# EAGLE design Spectron2 (EAGLE 8.0.1)
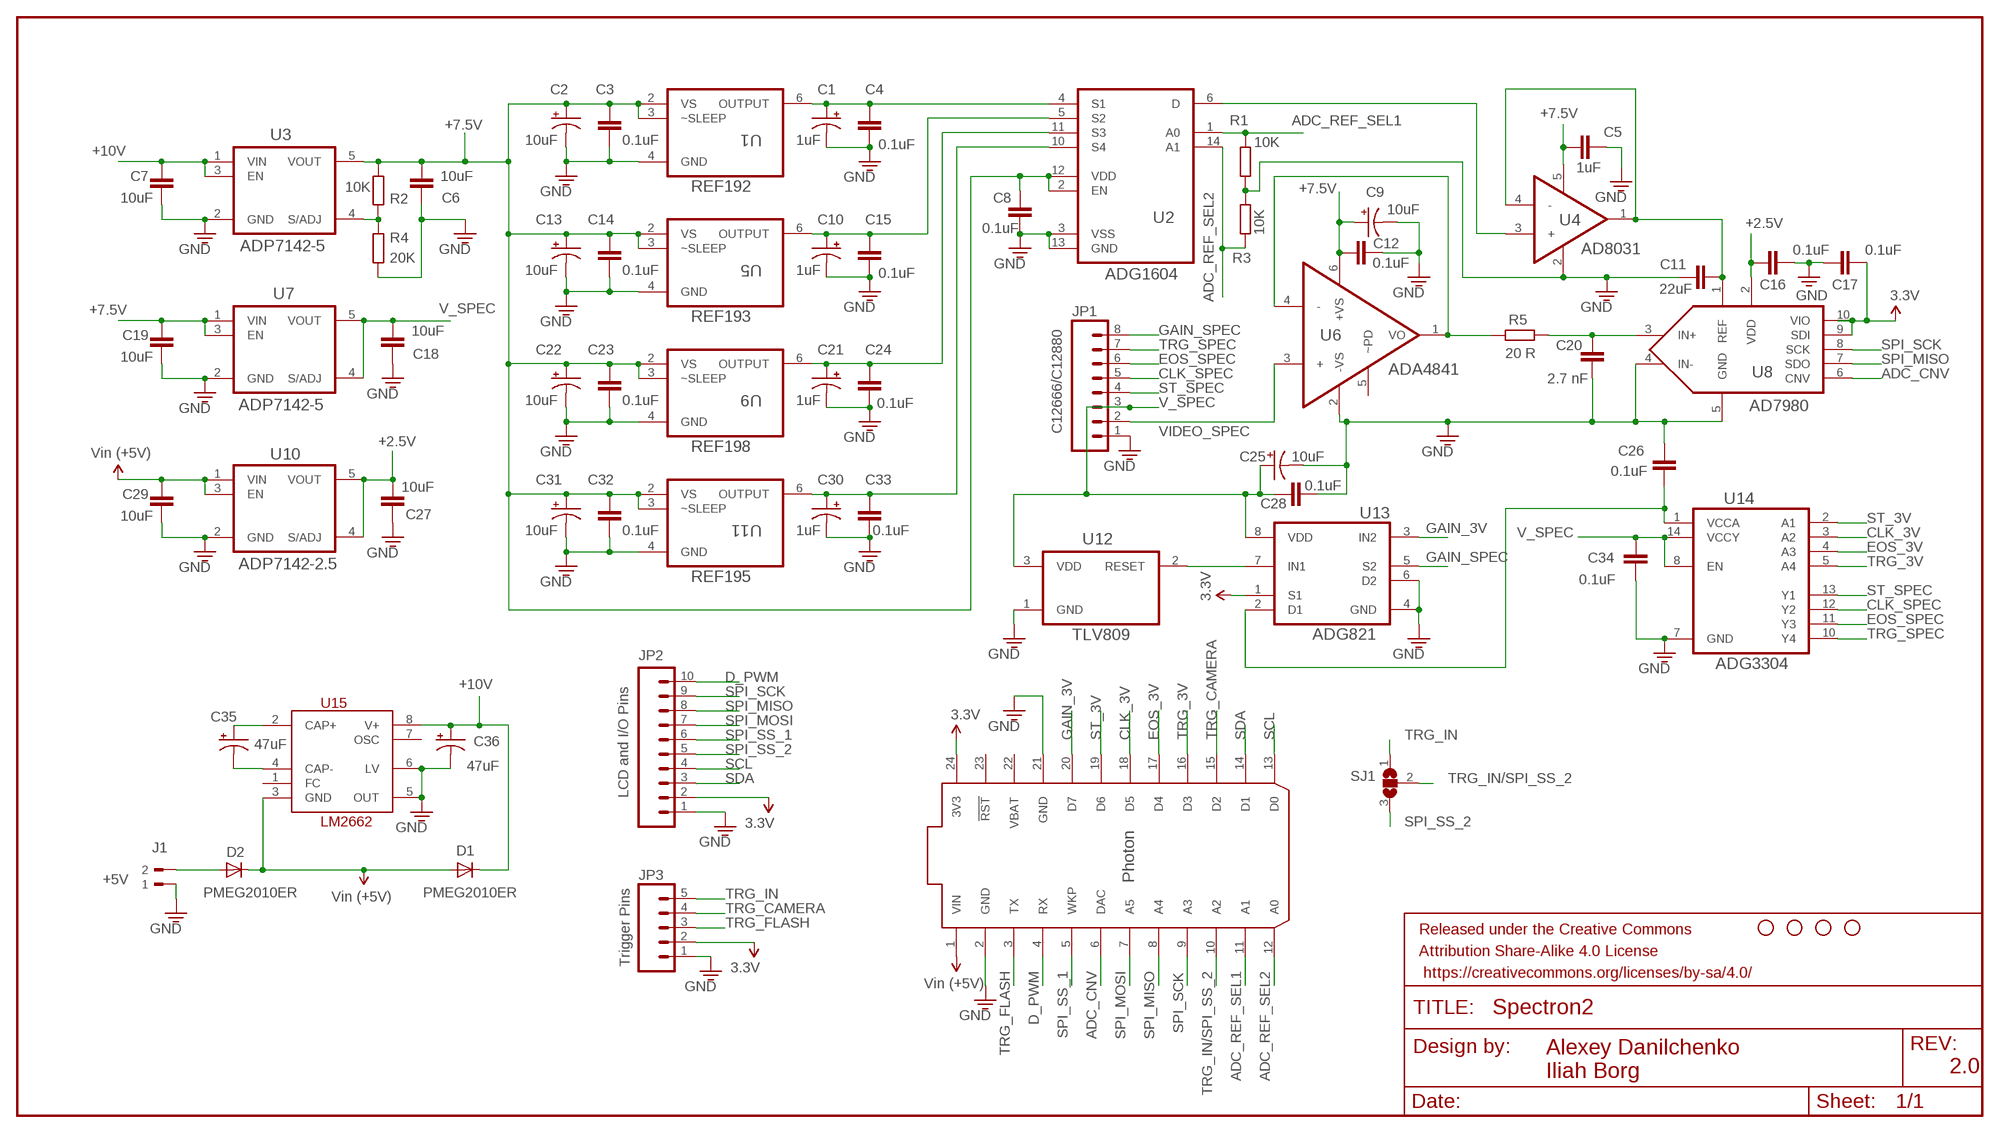
[diagram p0: schematic, sheet 1]

## Parts
C1  1uF  TANT-CAP1206  [EIA3216]
C2  10uF  TANT-CAP1206  [EIA3216]
C3  0.1uF  C-EUC0805  [C0805]
C4  0.1uF  C-EUC0805  [C0805]
C5  1uF  C-EUC0805  [C0805]
C6  10uF  C-EUC0805  [C0805]
C7  10uF  C-EUC0805  [C0805]
C8  0.1uF  C-EUC0805  [C0805]
C9  10uF  TANT-CAP1206  [EIA3216]
C10  1uF  TANT-CAP1206  [EIA3216]
C11  22uF  CAP1206  [1206]
C12  0.1uF  C-EUC0805  [C0805]
C13  10uF  TANT-CAP1206  [EIA3216]
C14  0.1uF  C-EUC0805  [C0805]
C15  0.1uF  C-EUC0805  [C0805]
C16  0.1uF  C-EUC0805  [C0805]
C17  0.1uF  C-EUC0805  [C0805]
C18  10uF  C-EUC0805  [C0805]
C19  10uF  C-EUC0805  [C0805]
C20  2.7 nF  C-EUC0805  [C0805]
C21  1uF  TANT-CAP1206  [EIA3216]
C22  10uF  TANT-CAP1206  [EIA3216]
C23  0.1uF  C-EUC0805  [C0805]
C24  0.1uF  C-EUC0805  [C0805]
C25  10uF  TANT-CAP1206  [EIA3216]
C26  0.1uF  C-EUC0805  [C0805]
C27  10uF  C-EUC0805  [C0805]
C28  0.1uF  C-EUC0805  [C0805]
C29  10uF  C-EUC0805  [C0805]
C30  1uF  TANT-CAP1206  [EIA3216]
C31  10uF  TANT-CAP1206  [EIA3216]
C32  0.1uF  C-EUC0805  [C0805]
C33  0.1uF  C-EUC0805  [C0805]
C34  0.1uF  C-EUC0805  [C0805]
C35  47uF  CPOL-USCT7343  [CT7343]
C36  47uF  CPOL-USCT7343  [CT7343]
D1  PMEG2010ER  DIODE-SOD123  [SOD123]
D2  PMEG2010ER  DIODE-SOD123  [SOD123]
FRAME1  FRAME-LEDGER  [CREATIVE_COMMONS]
J1  +5V  PM5.08/2/90BLK  [WEIDMULLER_PM5.08_2]
JP1  C12666/C12880  M08SILK_FEMALE_PTH  [1X08]
JP2  LCD and I/O Pins  M10SILK_FEMALE_PTH  [1X10]
JP3  Trigger Pins  M05PTH  [1X05]
R1  10K  R-EU_R0805  [R0805]
R2  10K  R-EU_R0805  [R0805]
R3  10K  R-EU_R0805  [R0805]
R4  20K  R-EU_R0805  [R0805]
R5  20 R  R-EU_R0805  [R0805]
SJ1  SJ2W  [SJ_2]
STANDOFF1  STAND-OFF  [STAND-OFF]
STANDOFF2  STAND-OFF  [STAND-OFF]
STANDOFF3  STAND-OFF  [STAND-OFF]
STANDOFF4  STAND-OFF  [STAND-OFF]
U1  REF192  [SOIC127P600X175-8N]
U2  ADG1604  [SOP65P640X120-14N]
U3  ADP7142-5  ADP7142  [SOT95P280X145-5N]
U4  AD8031  [SOT95P280X145-5N]
U5  REF193  [SOIC127P600X175-8N]
U6  ADA4841  [SOT95P280X145-6N]
U7  ADP7142-5  ADP7142  [SOT95P280X145-5N]
U8  AD7980  [SOP50P490X110-10N]
U9  REF198  [SOIC127P600X175-8N]
U10  ADP7142-2.5  ADP7142  [SOT95P280X145-5N]
U11  REF195  [SOIC127P600X175-8N]
U12  TLV809  [SOT95P237X112-3N]
U13  ADG821  [SOP65P490X110-8N]
U14  ADG3304  [SOP65P640X120-14N]
U15  LM2662  [SOIC8]
U16  PHOTON_WITH_HEADERS  [PHOTON]

## Nets
3.3V: C17.2 JP2.2 JP3.2 U8.9(SDI) U8.10(VIO) U13.1(S1) U16.24(3V3)
+2.5V: C16.1 C27.1 U8.2(VDD) U10.4(S/ADJ) U10.5(VOUT)
+7.5V: C2.A(+) C3.2 C5.2 C6.1 C8.2 C9.A(+) C12.2 C13.A(+) C14.2 C19.2 C22.A(+) C23.2 C31.A(+) C32.2 R2.1 U1.2(VS) U1.3(~SLEEP) U2.2(EN) U2.12(VDD) U3.5(VOUT) U4.5(+VS) U5.2(VS) U5.3(~SLEEP) U6.6(+VS) U7.1(VIN) U7.3(EN) U9.2(VS) U9.3(~SLEEP) U11.2(VS) U11.3(~SLEEP)
+10V: C7.2 C36.+ D1.C U3.1(VIN) U3.3(EN) U15.8(V+)
ADC_CNV: U8.6(CNV) U16.6(DAC)
ADC_REF_SEL1: R1.1 U2.1(A0) U16.11(A1)
ADC_REF_SEL2: R3.2 U2.14(A1) U16.12(A0)
CLK_3V: U14.3(A2) U16.18(D5)
CLK_SPEC: JP1.5 U14.12(Y2)
D_PWM: JP2.10 U16.4(RX)
EOS_3V: U14.4(A3) U16.17(D4)
EOS_SPEC: JP1.6 U14.11(Y3)
GAIN_3V: U13.3(IN2) U16.20(D7)
GAIN_SPEC: JP1.8 U13.5(S2)
GND: C1.C(-) C2.C(-) C3.1 C4.1 C5.1 C6.2 C7.1 C8.1 C9.C(-) C10.C(-) C11.1 C12.1 C13.C(-) C14.1 C15.1 C16.2 C17.1 C18.2 C19.1 C20.1 C21.C(-) C22.C(-) C23.1 C24.1 C25.C(-) C26.2 C27.2 C28.1 C29.1 C30.C(-) C31.C(-) C32.1 C33.1 C34.1 C36.- J1.1 JP1.1 JP2.1 JP3.1 R1.2 R3.1 R4.2 U1.4(GND) U2.3(VSS) U2.13(GND) U3.2(GND) U4.2(-VS) U5.4(GND) U6.2(-VS) U7.2(GND) U8.4(IN-) U8.5(GND) U9.4(GND) U10.2(GND) U11.4(GND) U12.1(GND) U13.4(GND) U13.6(D2) U14.7(GND) U15.5(OUT) U15.6(LV) U16.2(GND) U16.21(GND)
N$1: R2.2 R4.1 U3.4(S/ADJ)
N$2: C11.2 U4.1(VOUT) U4.4(-) U8.1(REF)
N$3: C21.A(+) C24.2 U2.11(S3) U9.6(OUTPUT)
N$4: R5.2 U6.1(VO) U6.4(-)
N$5: U12.2(RESET) U13.7(IN1)
N$7: C1.A(+) C4.2 U1.6(OUTPUT) U2.4(S1)
N$8: U2.6(D) U4.3(+)
N$9: C10.A(+) C15.2 U2.5(S2) U5.6(OUTPUT)
N$10: C30.A(+) C33.2 U2.10(S4) U11.6(OUTPUT)
N$11: D2.A J1.2
N$29: C20.2 R5.1 U8.3(IN+)
N$31: C35.- U15.4(CAP-)
N$32: C35.+ U15.2(CAP+)
N$35: C26.1 U13.2(D1) U14.1(VCCA)
SCL: JP2.4 U16.13(D0)
SDA: JP2.3 U16.14(D1)
SPI_MISO: JP2.8 U8.7(SDO) U16.8(A4)
SPI_MOSI: JP2.7 U16.7(A5)
SPI_SCK: JP2.9 U8.8(SCK) U16.9(A3)
SPI_SS_1: JP2.6 U16.5(WKP)
SPI_SS_2: JP2.5 SJ1.3
ST_3V: U14.2(A1) U16.19(D6)
ST_SPEC: JP1.4 U14.13(Y1)
TRG_3V: U14.5(A4) U16.16(D3)
TRG_CAMERA: JP3.4 U16.15(D2)
TRG_FLASH: JP3.3 U16.3(TX)
TRG_IN: JP3.5 SJ1.1
TRG_IN/SPI_SS_2: SJ1.2 U16.10(A2)
TRG_SPEC: JP1.7 U14.10(Y4)
V_SPEC: C18.1 C25.A(+) C28.2 C34.2 JP1.3 U7.4(S/ADJ) U7.5(VOUT) U12.3(VDD) U13.8(VDD) U14.8(EN) U14.14(VCCY)
VIDEO_SPEC: JP1.2 U6.3(+)
VIN: C29.2 D1.A D2.C U10.1(VIN) U10.3(EN) U15.3(GND) U16.1(VIN)
Unconnected: U6.5(~PD) U15.1(FC) U15.7(OSC) U16.23(!RST)

## Power pins joined to a net without a drawn wire
VBAT: U16.22(VBAT)

## Library data of the parts
C1 C10 C21 C30 = Spectron:TANT-CAP: Tantalum SMT
C2 C9 C13 C22 C25 C31 = Spectron2:TANT-CAP: Tantalum SMT
C3-C8 C12 C14-C20 C23 C24 C26-C29 C32-C34 = resistor:C-EU: CAPACITOR, European symbol
C11 = SparkFun-Capacitors:CAP: Capacitor Standard 0603 ceramic capacitor, and 0.1" leaded capacitor.
C35 C36 = resistor:CPOL-US: POLARIZED CAPACITOR, American symbol
D1 D2 = Spectron:DIODE-: DIODE
FRAME1 = SparkFun-Aesthetics:FRAME-LEDGER: Schematic Frame Standard 11x14 US Ledger frame
J1 = WEIDMULLER-PM5.08_2_90BLK:PM5.08/2/90BLK: TERMINAL BLOCK, SIDE ENTRY, 2WAY; MPN: PM5.08/2/90 BLK; OC_FARNELL: 1131855; OC_NEWARK: 26M1980; PACKAGE: TH-R/A; SUPPLIER: WEIDMULLER
JP1 = SparkFun-Connectors:M08: Header 8 Standard 8-pin 0.1" header. Use with straight break away headers (SKU : PRT-00116), right angle break away headers (PRT-00553), swiss pins (PRT-00743), machine pins (PRT-00117), and female headers (PRT-00115).; PROD_ID: CONN-08438
JP2 = SparkFun-Connectors:M10: Header 10 Standard 10-pin 0.1" header. Use with straight break away headers (SKU : PRT-00116), right angle break away headers (PRT-00553), swiss pins (PRT-00743), machine pins (PRT-00117), and female headers (PRT-00115).; PROD_ID: CONN-11563
JP3 = SparkFun-Connectors:M05: Header 5 Standard 5-pin 0.1" header. Use with straight break away headers (SKU : PRT-00116), right angle break away headers (PRT-00553), swiss pins (PRT-00743), machine pins (PRT-00117), and female headers (PRT-00115). Molex polarized connector foot print use with SKU : PRT-08230 with associated crimp pins and housings.
R1-R5 = resistor:R-EU_: RESISTOR, European symbol
SJ1 = jumper:SJ2W: SMD solder JUMPER
STANDOFF1-STANDOFF4 = Spectron:STAND-OFF: #4 Stand Off This is the mechanical footprint for a #4 phillips button head screw. Use the keepout ring to avoid running the screw head into surrounding components. SKU : PRT-00447
U1 = ADI-REF19xx:REF192: Precision Micropower, Low Dropout Voltage References; MPN: REF192; OC_FARNELL: -; OC_NEWARK: 19M9005; PACKAGE: SOIC-8; SUPPLIER: ANALOG DEVICES
U2 = ADI-ADG1604:ADG1604: 1 Ù Typical On Resistance, ±5 V,+12 V, +5 V, and +3.3 V, 4:1 Multiplexer; MPN: ADG1604BRUZ; OC_FARNELL: 1827326; OC_NEWARK: 71P7802; PACKAGE: TSSOP-14; SUPPLIER: Analog Devices
U3 U7 U10 = ADI-ADP7142:ADP7142: Amplifiers; MPN: ADP7142; OC_FARNELL: 1319421; OC_NEWARK: 19M8875; PACKAGE: SOT23-5; SUPPLIER: Analog Devices
U4 = ADI-AD8031:AD8031: Amplifiers; MPN: AD8031; OC_FARNELL: 1319421; OC_NEWARK: 19M8875; PACKAGE: SOT23-5; SUPPLIER: Analog Devices
U5 = ADI-REF19xx:REF193: Precision Micropower, Low Dropout Voltage References; MPN: REF193; OC_FARNELL: -; OC_NEWARK: 19M9005; PACKAGE: SOIC-8; SUPPLIER: ANALOG DEVICES
U6 = ADI-ADA4841:ADA4841: Low Power, Low Noise and Distortion, Rail-to-Rail Output Amplifier; MPN: ADA4841-1YRJZ-R2; OC_FARNELL: 1838874; OC_NEWARK: 59K0892; PACKAGE: SOT-23-6; SUPPLIER: Analog Devices
U8 = ADI-AD7980:AD7980: PulSAR Analog-to-Digital Converters; MPN: AD7980ARMZ; OC_FARNELL: 1607233; OC_NEWARK: 54M6760; PACKAGE: MSOP-10; SUPPLIER: Analog Devices
U9 = ADI-REF19xx:REF198: Precision Micropower, Low Dropout Voltage References; MPN: REF198; OC_FARNELL: -; OC_NEWARK: 19M9005; PACKAGE: SOIC-8; SUPPLIER: ANALOG DEVICES
U11 = ADI-REF19xx:REF195: Precision Micropower, Low Dropout Voltage References; MPN: REF195; OC_FARNELL: -; OC_NEWARK: 19M9005; PACKAGE: SOIC-8; SUPPLIER: ANALOG DEVICES
U12 = TI-TLV809:TLV809: 3-Pin Voltage Supervisors; MPN: TLV80950; OC_FARNELL: 1972804; OC_NEWARK: 59T0102; PACKAGE: SOT-23-3; SUPPLIER: Texas Instruments
U13 = ADI-ADG821:ADG821: Dual SPST Switches; MPN: ADG821BRMZ; OC_FARNELL: 1661039; OC_NEWARK: 19M8674; PACKAGE: MSOP-8; SUPPLIER: ANALOG DEVICES
U14 = ADI-ADG3304:ADG3304: Low Voltage, 1.15 V to 5.5 V, 4-Channel, Bidirectional Logic Level Translator; MPN: ADG3304; OC_FARNELL: 1078228; OC_NEWARK: 19M0672; PACKAGE: TSSOP-14; SUPPLIER: Analog Devices
U15 = LM2662:LM2662
U16 = Spark:PHOTON

## Net classes
1 power: width 0.61 mm, drill 0.61 mm, clearance 0.254 mm
2 gnd: width 0.305 mm, drill 0.559 mm, clearance 0.254 mm
3 usbvcc: width 0.508 mm, drill 0.61 mm, clearance 0.254 mm

## Board
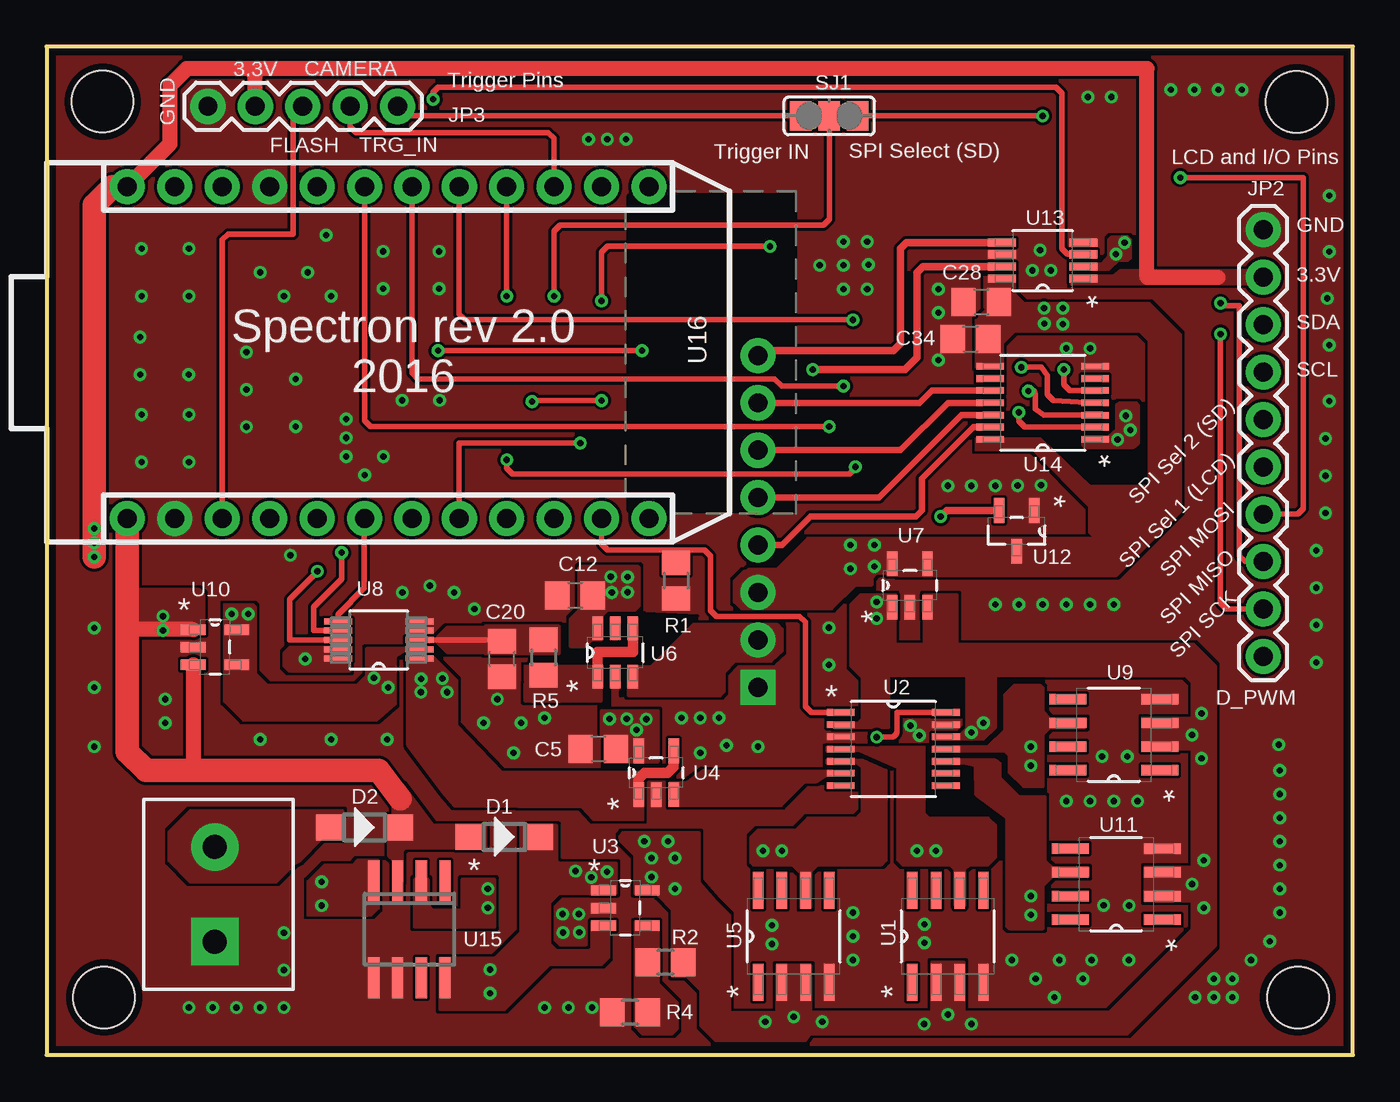
[diagram p1: board, top side]
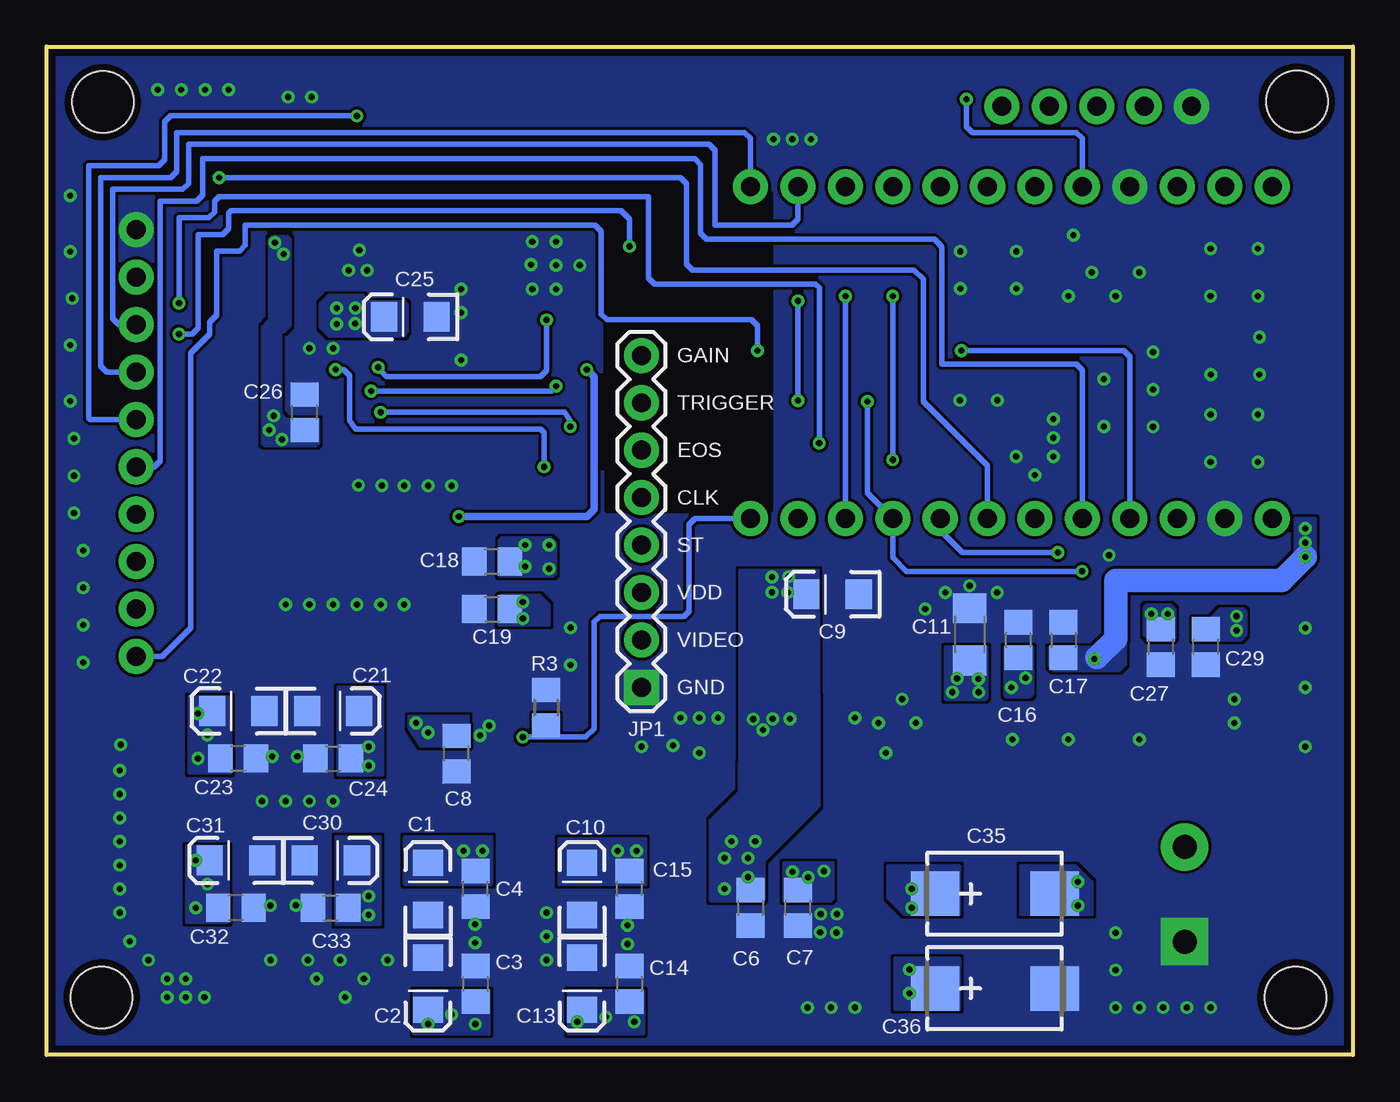
[diagram p2: board, bottom side, seen from below]

Size 69.95 x 54 mm. Coordinates in mm from the lower left corner, seen from the top.
Outline: 0,0 69.95,0 69.95,54 0,54 0,0
Copper layers (1*16): Top 0.0356mm / dielectric 1.5011mm / Bottom 0.0356mm
Design rules "oshpark-2layer *": minimum track width 6mil, minimum drill 13mil, track to track 6mil, track to pad 6mil, pad to pad 6mil, via to via 6mil, smd to smd 0mil, copper to edge 15mil, drill to drill 6mil, minimum pad ring 7mil, minimum via ring 7mil, stop-mask expansion 2.5mil, vias tented up to drill 0mil, thermal gap 10mil

### Footprints (pad centres in the part's own frame; a part is rotated, then mirrored left to right if it is on the bottom)
EIA3216 = smd 1.4 x 1.6: A 1.4,0; C -1.4,0
C0805 = smd 1.3 x 1.5: 1 -0.95,0; 2 0.95,0
1206 = smd 1.6 x 1.8: 1 -1.4,0; 2 1.4,0
CT7343 = smd 2.6 x 2.4: + 3.2,0; - -3.2,0
SOD123 = smd 1.4 x 1.4: A 1.9,0; C -1.9,0
WEIDMULLER_PM5.08_2 = drill 1.3 pad 2.54 square: 1 -2.54,0 | drill 1.3 pad 2.54: 2 2.54,0
1X08 = drill 1.016 pad 1.88 square: 1 0,0 | drill 1.016 pad 1.88: 2 2.54,0; 3 5.08,0; 4 7.62,0; 5 10.16,0; 6 12.7,0; 7 15.24,0; 8 17.78,0
1X10 = drill 1.016 pad 1.88: 1 0,0; 2 2.54,0; 3 5.08,0; 4 7.62,0; 5 10.16,0; 6 12.7,0; 7 15.24,0; 8 17.78,0; 9 20.32,0; 10 22.86,0
1X05 = drill 1.016 pad 1.88: 1 0,0; 2 2.54,0; 3 5.08,0; 4 7.62,0; 5 10.16,0
R0805 = smd 1.3 x 1.5: 1 -0.95,0; 2 0.95,0
SJ_2 = smd 1.168 x 1.6: 1 -1.524,0; 2 0,0; 3 1.524,0
STAND-OFF = hole 3.302: 0,0
SOIC127P600X175-8N = smd 1.981 x 0.559: 1 -2.464,1.905; 2 -2.464,0.635; 3 -2.464,-0.635; 4 -2.464,-1.905; 5 2.464,-1.905; 6 2.464,-0.635; 7 2.464,0.635; 8 2.464,1.905
SOP65P640X120-14N = smd 1.473 x 0.356: 1 -2.819,1.956; 2 -2.819,1.295; 3 -2.819,0.66; 4 -2.819,0; 5 -2.819,-0.66; 6 -2.819,-1.295; 7 -2.819,-1.956; 8 2.819,-1.956; 9 2.819,-1.295; 10 2.819,-0.66; 11 2.819,0; 12 2.819,0.66; 13 2.819,1.295; 14 2.819,1.956
SOT95P280X145-5N = smd 1.321 x 0.559: 1 -1.168,0.94; 2 -1.168,0; 3 -1.168,-0.94; 4 1.168,-0.94; 5 1.168,0.94
SOT95P280X145-6N = smd 1.27 x 0.559: 1 -1.295,0.94; 2 -1.295,0; 3 -1.295,-0.94; 4 1.295,-0.94; 5 1.295,0; 6 1.295,0.94
SOP50P490X110-10N = smd 1.499 x 0.33: 1 -2.184,0.991; 2 -2.184,0.508; 3 -2.184,0; 4 -2.184,-0.508; 5 -2.184,-0.991; 6 2.184,-0.991; 7 2.184,-0.508; 8 2.184,0; 9 2.184,0.508; 10 2.184,0.991
SOT95P237X112-3N = smd 1.321 x 0.559: 1 -1.092,0.94; 2 -1.092,-0.94; 3 1.092,0
SOP65P490X110-8N = smd 1.499 x 0.432: 1 -2.184,0.965; 2 -2.184,0.33; 3 -2.184,-0.33; 4 -2.184,-0.965; 5 2.184,-0.965; 6 2.184,-0.33; 7 2.184,0.33; 8 2.184,0.965
SOIC8 = smd 0.6 x 2.2: 1 -1.905,-2.6; 2 -0.635,-2.6; 3 0.635,-2.6; 4 1.905,-2.6; 5 1.905,2.6; 6 0.635,2.6; 7 -0.635,2.6; 8 -1.905,2.6
PHOTON = drill 1.016 pad 1.88: 1 1.27,32.258; 2 1.27,29.718; 3 1.27,27.178; 4 1.27,24.638; 5 1.27,22.098; 6 1.27,19.558; 7 1.27,17.018; 8 1.27,14.478; 9 1.27,11.938; 10 1.27,9.398; 11 1.27,6.858; 12 1.27,4.318; 13 19.05,4.318; 14 19.05,6.858; 15 19.05,9.398; 16 19.05,11.938; 17 19.05,14.478; 18 19.05,17.018; 19 19.05,19.558; 20 19.05,22.098; 21 19.05,24.638; 22 19.05,27.178; 23 19.05,29.718; 24 19.05,32.258

### Placement (x,y rotation side)
C1  49.53,8.89 90 bottom
C2  49.53,3.81 270 bottom
C3  46.99,3.81 270 bottom
C4  46.99,8.89 90 bottom
C5  29.54,16.4 0 top
C6  32.26,7.87 270 bottom
C7  29.72,7.87 90 bottom
C8  48.01,16.13 90 bottom
C9  27.86,24.67 180 bottom
C10  41.27,8.89 90 bottom
C11  20.52,22.52 270 bottom
C12  28.29,24.62 0 top
C13  41.27,3.81 270 bottom
C14  38.73,3.81 270 bottom
C15  38.73,8.89 90 bottom
C16  17.91,22.23 90 bottom
C17  15.49,22.23 270 bottom
C18  46.1,26.42 180 bottom
C19  46.1,23.88 0 bottom
C20  24.38,21.21 90 top
C21  54.61,18.41 0 bottom
C22  59.69,18.41 180 bottom
C23  59.69,15.88 180 bottom
C24  54.61,15.88 0 bottom
C25  50.47,39.53 180 bottom
C26  56.13,34.42 90 bottom
C27  10.29,21.84 270 bottom
C28  50.04,40.33 0 top
C29  7.87,21.84 90 bottom
C30  54.74,10.41 0 bottom
C31  59.82,10.41 180 bottom
C32  59.82,7.87 180 bottom
C33  54.74,7.87 0 bottom
C34  49.47,38.34 0 top
C35  19.18,8.64 180 bottom
C36  19.18,3.56 180 bottom
D1  24.51,11.68 180 top
D2  17.02,12.19 180 top
FRAME1  -0.04,0.23 0 top
J1  9,8.6 90 top
JP1  38.1,19.68 90 bottom
JP2  65.15,44.2 270 top
JP3  8.64,50.8 0 top
R1  33.7,25.4 270 top
R2  33.15,4.95 180 top
R3  43.2,18.6 270 bottom
R4  31.24,2.29 180 top
R5  26.61,21.28 270 top
SJ1  41.91,50.29 0 top
STANDOFF1  3.08,3.08 0 top
STANDOFF2  2.99,51.05 0 top
STANDOFF3  67.01,3.08 0 top
STANDOFF4  66.94,51.03 0 top
U1  48.26,6.35 90 top
U2  45.34,16.38 0 top
U3  30.99,7.87 0 top
U4  32.64,15.11 90 top
U5  40.01,6.35 90 top
U6  30.45,21.55 90 top
U7  46.23,25.15 90 top
U8  17.78,22.23 180 top
U9  57.15,17.14 180 top
U10  9.02,21.84 0 top
U11  57.28,9.14 180 top
U12  51.94,28.07 270 top
U13  53.34,42.55 180 top
U14  53.34,34.92 180 top
U15  19.43,6.73 180 top
U16  36.58,27.46 90 top

### Tracks (layer width: path | path; a pad name or v marks a point on that pad's centre or on a via)
3.3V  (via drill 0.33 pad 0.18)
  Top 0.813: U16.24 6.6,48.8 6.6,51.94 7.49,52.83 10.86,52.83 | JP3.2 11.18,52.51 10.86,52.83 | 10.86,52.83 58.93,52.83 58.93,41.66 62.74,41.66
  Top 1.27: U16.24 3.54,46.51 2.54,45.51 v2.54,26.67
  Bottom 1.27: v2.54,26.67 3.81,25.4 12.7,25.4 12.7,22.27 13.7,21.27
  other vias: 13.84,21.21 2.54,27.43 2.54,28.19
  pour Top (no thermals): 54.86,41.73 57.15,41.73 57.53,42.04 65.79,42.04 65.79,41.27 54.86,41.27
  pour Bottom (no thermals): 16.26,21.84 13.21,21.84 13.02,21.84 12.7,21.53 12.7,20.83 12.95,20.57 16,20.57 16.26,20.83
  pour Top (no thermals): 16.26,21.84 13.02,21.84 12.7,21.53 12.7,20.83 12.95,20.57 16.26,20.57
  pour Bottom (no thermals): 12.19,22.23 12.19,20.89 12.51,20.57 13.59,20.57 13.59,21.91 13.27,22.23
  pour Bottom (no thermals): 3.05,26.42 2.03,26.67 2.03,28.7 3.05,28.7
+2.5V  (via drill 0.33 pad 0.18)
  other vias: 9.91,23.62 17.53,20.19 10.79,23.62 18.29,19.68
  pour Bottom (no thermals): 17.14,21.84 18.67,21.84 18.67,19.3 18.54,19.18 17.27,19.18 17.14,19.3
  pour Bottom (no thermals): 9.65,22.23 10.92,22.23 11.18,22.48 11.18,24 11.05,24.13 9.78,24.13 9.53,23.88 9.53,22.35
  pour Top (no thermals): 9.53,24.13 11.05,24.13 11.18,24 11.18,20.45 11.81,19.81 16.64,19.81 17.14,20.32 17.14,21.79 20.57,21.79 20.57,21.64 19.15,21.64 18.67,21.34 18.67,18.8 17.65,17.91 10.54,17.91 9.53,18.92
+7.5V  (via drill 0.33, 0.33 pad 0.18)
  other vias: 33.66,8.89 32.38,9.53 40.01,2.03 48.26,2.16 61.34,17.14 61.34,9.14 44.45,23.37 50.16,17.78 33.66,10.54 32,11.43 33.27,11.43 32.38,10.54 41.53,1.78 38.48,1.78 44.45,24.26 46.99,1.65 49.53,1.65 61.98,10.41 61.98,7.87 61.85,15.88 61.85,18.29 49.53,17.27 32.11,17.98 30.15,17.99 31.07,18 31.59,17.4 31.11,25.59 30.21,25.61 30.26,24.77 31.1,24.78
  pour Bottom (no thermals): 34.04,8.26 32.26,8.26 31.62,8.26 31.5,8.38 31.5,10.29 34.16,10.29 34.16,8.26
  pour Bottom (no thermals): 32.85,25.94 32.84,16.89 28.7,16.89 28.57,17.02 28.61,25.96
  pour Top (no thermals): 32.76,18.43 29.68,18.42 29.68,17.16 29.87,17.18 29.87,15.69 32.76,15.7
  pour Bottom (no thermals): 31.75,10.16 28.57,13.34 28.57,17.27 32.85,17.26 32.88,14.09 34.42,12.57 34.42,8.26 31.75,8.26
  pour Top (no thermals): 31.5,8.64 31.5,10.67 30.73,11.43 30.71,11.72 30.86,11.93 34.92,11.93 34.92,9.27 35.81,8.26 36.58,7.49 36.58,2.29 39.12,2.29 39.12,4.83 40.89,4.83 40.89,1.14 40.64,0.76 35.81,0.76 35.05,1.52 35.05,3.43 34.29,4.19 33.53,4.19 33.53,7.75 32.77,8.51 32.77,8.64
  pour Bottom (no thermals): 37.97,3.43 42.04,3.43 42.04,1.14 37.97,1.14
  pour Top (no thermals): 40.01,1.14 49.09,1.14 49.15,1.21 49.15,4.95 47.37,4.95 47.37,2.29 40.01,2.29
  pour Bottom (no thermals): 46.23,3.43 50.29,3.43 50.29,1.14 46.23,1.14
  pour Bottom (no thermals): 60.2,7.11 60.2,11.18 62.48,11.18 62.48,7.11
  pour Bottom (no thermals): 60.07,15.11 60.07,19.18 62.36,19.18 62.36,15.11
  pour Top (no thermals): 48.26,1.14 57.91,1.14 62.61,5.84 62.61,18.03 58.67,18.03 58.67,16.38 61.34,16.38 61.34,10.03 58.8,10.03 58.8,8.26 61.34,8.26 61.34,6.73 56.9,2.29 48.39,2.29
  pour Top (no thermals): 62.61,17.14 62.61,20.83 61.47,21.97 48.77,21.97 48.77,24.64 46.99,24.64 46.99,21.97 45.47,21.97 45.47,24.64 43.56,24.64 43.05,24.13 43.05,20.83 43.56,20.32 60.96,20.32 61.34,19.94 61.34,17.14
  pour Bottom (no thermals): 45.72,24.51 45.59,24.64 43.56,24.64 43.05,24.13 43.05,22.99 45.72,22.99
  pour Top (no thermals): 47.5,17.14 48.9,17.14 49.28,17.53 49.28,21.34 50.42,21.34 50.8,21.21 50.8,17.53 50.16,16.89 47.5,16.89
  pour Bottom (no thermals): 47.37,16.51 49.91,16.51 50.55,17.53 50.55,18.16 47.37,18.16
  pour Top (no thermals): 42.16,17.53 42.16,17.78 43.43,17.78 43.69,18.03 43.69,20.19 43.56,20.32 43.56,20.95 45.09,20.95 45.09,17.53
  pour Top (no thermals): 29.72,22.25 29.72,23.42 29.71,23.43 29.71,23.49 29.95,23.73 30.05,23.83 31.53,23.83 31.75,24.05 31.75,26.1 31.68,26.17 28.57,26.17 28.49,26.09 28.49,23.8 28.03,23.34 28.02,23.33 28.02,21.88 28.81,21.88 28.84,21.88 29.27,22.24
+10V  (via drill 0.33 pad 0.18)
  other vias: 23.75,4.57 28.32,9.85 23.75,3.3 30.02,9.8 29.16,9.51
  pour Top (no thermals): 21.08,5.21 24,5.21 25.4,6.6 25.4,12.32 27.3,12.32 27.3,10.41 27.43,10.29 30.48,10.29 30.48,8.64 27.43,8.64 26.92,8.13 26.92,5.97 27.3,5.59 29.08,5.59 29.21,5.71 29.21,7.11 30.1,7.11 30.1,5.21 29.72,4.83 26.92,4.83 24.51,2.41 21.08,2.41
  pour Bottom (no thermals): 21.08,2.41 24.51,2.41 24.51,5.21 21.08,5.21
  pour Bottom (no thermals): 30.35,8.26 28.57,8.26 27.94,8.26 27.81,8.38 27.81,10.29 30.48,10.29 30.48,8.26
ADC_CNV
  Top 0.305: U16.6 17,28.73 17,25 15.6,23.6 U8.6
ADC_REF_SEL1
  Top 0.3: R1.1 33.7,27.05 35,27.05
  Top 0.305: U2.1 40.96,18.34 40.64,18.66 40.64,23.18 40.32,23.5 35.88,23.5 35.56,23.81 35.56,26.73 35.24,27.05 35,27.05 30.04,27.05 29.72,27.37 U16.11
ADC_REF_SEL2  (via drill 0.33 pad 0.18)
  Top 0.305: U2.14 45.53,18.34 45.53,17.34 arc-90 45.21,17.02 v44.45,17.02
  Bottom 0.3: v44.45,17.02 43.2,17.02 R3.2
  Bottom 0.305: v44.45,17.02 41.08,17.02 40.64,17.46 40.64,23.18 40.32,23.5 35.81,23.5 35.56,23.75 35.56,28.41 35.24,28.73 U16.12
CLK_3V  (via drill 0.33 pad 0.18)
  Top 0.305: U14.3 53.4,34.27 52.96,34.58 52.96,35.37 52.9,35.56 v52.58,35.56 | v42.67,35.81 39.37,35.81 38.99,36.2 19.88,36.2 19.56,36.51 U16.18
  Bottom 0.305: v52.58,35.56 42.93,35.56 v42.67,35.81
CLK_SPEC
  Top 0.356: U14.12 49,34.27 44.58,29.84 JP1.5
D_PWM  (via drill 0.33 pad 0.18)
  Top 0.305: v31.88,37.72 v20.95,37.72
  Bottom 0.305: v31.88,37.72 31.88,39.05 32.19,39.37 39.94,39.37 40.26,39.69 40.26,44.13 40.58,44.45 59.31,44.45 59.31,43.37 59.63,43.05 60.83,43.05 60.83,39.62 61.21,39.24 61.21,38.61 62.23,37.59 62.23,22.86 63.75,21.34 JP2.10 | v20.95,37.72 12.26,37.72 11.94,37.4 U16.4
EOS_3V  (via drill 0.33 pad 0.18)
  Top 0.305: U14.4 53.91,35.05 53.59,35.37 53.59,36.39 53.28,36.83 v52.2,36.83 | v43.18,39.37 22.42,39.37 22.1,39.69 U16.17
  Bottom 0.305: v52.2,36.83 51.82,36.39 51.75,36.32 43.5,36.32 43.18,36.64 v43.18,39.37
EOS_SPEC
  Top 0.356: U14.11 48.26,34.92 45.72,32.38 JP1.6
GAIN_3V  (via drill 0.33 pad 0.18)
  Top 0.305: U13.3 54.67,42.88 54.36,43.19 54.36,51.5 54.04,51.82 20.95,51.82 20.7,51.56 v20.7,51.18
  Bottom 0.305: v20.7,51.18 20.7,49.72 20.38,49.4 14.8,49.4 14.48,49.09 U16.20
GAIN_SPEC
  Top 0.406: U13.5 46.04,43.51 45.72,43.19 45.72,38.1 45.34,37.72 38.35,37.72 JP1.8
GND  (via drill 0.33 pad 0.18)
  other vias: 25.4,17.78 52,30.5 47.75,41.02 55.75,51.31 46.26,17.63 66.04,15.24 61.47,51.69 55.88,37.85 20.52,25.13 5.08,43.18 7.62,43.18 5.08,40.64 7.62,40.64 5.08,34.29 7.62,34.29 5.08,31.75 7.62,31.75 11.43,41.91 13.97,41.91 15.24,40.64 12.7,40.64 13.34,36.2 13.34,33.66 6.35,19.05 6.35,17.78 2.54,22.86 2.54,19.68 2.54,16.51 11.43,16.89 15.24,16.89 19.05,24.77 21.82,24.77 26.67,18.05 24.13,19.05 12.7,2.54 7.62,2.54 8.89,2.54 10.16,2.54 11.43,2.54 27.94,2.54 26.67,2.54 29.21,2.54 38.1,16.51 36,18.04 43.18,7.62 43.18,6.35 43.18,5.08 27.63,7.54 51.69,5.08 52.96,4.08 54.23,5.08 55.5,4.08 47,7 38.84,6.94 56.6,8 57.88,15.98 54.61,13.59 55.88,13.59 57.15,13.59 66.04,13.97 66.04,12.7 66.04,11.43 66.04,10.16 66.04,8.89 66.04,7.62 58.42,13.59 50.8,24.13 52.07,24.13 53.34,24.13 54.61,24.13 55.88,24.13 57.15,24.13 48.26,30.48 49.53,30.48 50.8,30.48 47.75,39.75 47.75,37.21 41.4,42.29 42.67,42.29 42.67,41.02 43.94,41.02 42.67,43.56 43.94,43.56 62.74,51.69 64.01,51.69 60.2,51.69 57.02,51.31 54.61,37.85 46.74,17.12 12.7,4.54 12.7,6.54 28.5,7.54 27.65,6.55 28.52,6.57 38.84,5.94 47,6 62.5,4.08 63.5,4.08 61.5,3.08 62.5,3.08 63.5,3.08 57.97,7.99 56.52,15.99 65.99,16.62 53.26,30.51 53.2,43.11 52.78,42.02 53.78,42.02 44,42.32 35,18.04 34,18.04 14.97,43.91 10.7,37.64 10.7,35.64 10.7,33.64 5,36.44 5,38.44 7.6,36.44 29.02,49.04 30.02,49.04 31.02,49.04 18.02,43.04 18.02,41.04 21.02,43.04 21.02,41.04 23.4,17.78 25,16.18 35,16.18 36.4,16.58 41.9,22.88 41.9,20.88 22.9,23.88 18.24,16.89 53.96,3.08 57.96,5.08 55.96,5.08 64.5,5.08 65.5,6.08 67.99,21.02 67.99,23.02 67.99,25.02 67.99,27.02 68.49,29.02 68.49,31.02 68.49,33.02 68.69,35.02 68.69,38.02 68.59,40.52 68.69,43.02 68.69,46.02 13.05,26.77 16.04,32.05 18.04,32.05 16.04,34.05 17.04,31.05 16.04,33.05 19.04,35.05 21.04,35.05
  pour Top (rank 6, no thermals): 0.25,53.85 0.25,47.62 0.25,0.25 69.72,0.25 69.72,53.85
  pour Bottom (rank 6, no thermals): 0.25,0.25 69.72,0.25 69.72,53.85 0.25,53.85
  cutout Top (no thermals): 30,21 29.99,21.12 30.91,21.1 30.91,20.68 30.01,20.68
  cutout Top (no thermals): 30.76,20.54 30.95,20.35 30.95,19.22 30.73,19.21 30.76,19.24 30.74,19.49 30.77,19.52 30.76,19.53
N$1
  pour Top (no thermals): 31.5,7.11 31.5,4.19 31.5,1.52 31.88,1.14 32,1.14 33.53,1.14 33.78,1.4 33.78,2.79 32.77,3.81 32.77,7.11
N$2  (via drill 0.33 pad 0.18)
  Top 0.559: U4.4 33.58,15.43 33.26,15.11 32.02,15.11 31.7,14.8 U4.1
  other vias: 21.44,19.43 20.04,19.43 20.05,20.14 21.19,20.16
  pour Top (no thermals): 19.3,21.31 19.3,16.64 21.21,14.1 21.84,13.34 28.64,13.29 29.26,12.61 31.94,12.6 31.9,15.12 24.38,15.14 21.97,17.65 21.97,20.06 20.7,21.33 20.7,21.31
  pour Bottom (no thermals): 19.56,21.84 21.84,21.84 21.84,19.05 19.68,19.05 19.56,19.18
N$3  (via drill 0.33 pad 0.18)
  other vias: 52.7,16.51 52.7,15.49
  pour Bottom (no thermals): 51.94,14.99 51.94,19.68 54.36,19.68 54.36,14.99
  pour Top (no thermals): 47.5,16.51 50.42,16.51 51.31,17.4 51.31,19.3 51.82,19.81 53.21,19.81 53.34,19.68 53.34,18.41 53.72,18.03 55.63,18.03 55.63,17.53 53.72,17.53 53.34,17.14 53.34,14.35 52.32,14.35 51.56,15.11 51.56,16 51.31,16.26 47.5,16.26
N$4
  Top 0.55: U6.4 31.39,21.58 29.51,21.58 U6.1
  pour Top (no thermals): 26.02,20.83 29.72,20.83 29.7,18.94 25.63,18.94 25.64,20.88 25.65,20.84
N$5  (via drill 0.33 pad 0.18)
  Top 0.406: U13.7 46.93,42.22 46.61,41.9 46.61,37.34 45.97,36.7 v41.02,36.7 | v47.88,28.83 48.21,29.16 U12.2
  Bottom 0.406: v41.02,36.7 40.64,36.32 40.64,29.21 41.02,28.83 v47.88,28.83
N$6
  cutout Bottom: 40.01,46.1 31.24,46.1 31.24,29.21 39.88,29.21
N$7  (via drill 0.33 pad 0.18)
  other vias: 47.62,10.92 46.61,10.92
  pour Bottom (no thermals): 46.1,11.68 50.8,11.68 50.8,9.14 46.1,9.14
  pour Top (no thermals): 41.78,16.48 46.99,16.51 46.99,12.95 47.24,12.7 50.42,12.7 50.8,12.32 50.8,10.54 50.42,10.16 49.4,10.16 49.15,9.91 49.15,8 48.64,8 48.64,9.91 48.39,10.16 45.85,10.16 45.59,10.41 45.59,15.37 43.59,16.27 41.77,16.29
N$8
  pour Top (no thermals): 33.4,14.61 34.29,14.61 35.18,15.24 43.19,15.2 43.18,14.99 41.8,15 41.2,14.6 40.59,14.6 39.33,13.32 33.4,13.34
N$9  (via drill 0.33 pad 0.18)
  other vias: 39.37,10.92 38.35,10.92
  pour Bottom (no thermals): 37.85,11.56 42.55,11.56 42.55,9.14 37.85,9.14
  pour Top (no thermals): 40.39,7.87 40.39,9.78 40.32,9.78 40.01,10.1 40.01,10.16 37.85,10.16 37.72,10.29 37.72,11.68 38.1,12.06 40.13,12.06 40.77,12.7 43.37,12.7 43.69,13.02 43.69,15.37 43.41,15.62 41.78,15.62 41.78,15.81 43.68,15.79 44.96,15.24 44.96,10.41 44.7,10.16 41.27,10.16 40.89,9.78 40.89,7.87
N$10  (via drill 0.33 pad 0.18)
  other vias: 52.7,8.51 52.7,7.49
  pour Bottom (no thermals): 52.07,6.99 52.07,11.68 54.48,11.68 54.48,6.99
  pour Top (no thermals): 47.49,15.81 50.77,15.81 51.05,15.62 51.05,14.86 52.07,13.84 53.47,13.84 53.47,10.41 53.85,10.03 55.75,10.03 55.75,9.53 53.85,9.53 53.34,9.02 53.34,6.73 51.56,6.73 51.44,6.86 51.44,12.7 49.77,13.94 49.75,15.49 49.23,15.59 47.5,15.62
N$11
  pour Top (no thermals): 15.88,13.08 7.67,13.08 6.53,11.94 6.53,10.41 7.67,9.27 12.32,9.27 13.34,10.29 13.59,10.41 14.73,11.56 15.88,11.56
N$12
  cutout Top: 40.01,45.97 31.24,45.97 31.24,29.21 40.01,29.21
N$13
  cutout Top (no thermals): 30.03,20.55 arc90 29.99,20.51 29.99,18.77 arc90 30.02,18.74 30.13,18.74 arc90 30.15,18.76 30.17,18.78 30.17,20.56 30.16,20.55
N$15
  cutout Top (no thermals): 31.88,23.53 32.02,23.67 34.87,23.53 34.56,23.33 32.32,21.09 32,21.09 31.89,21.2 31.92,21.23 31.9,21.25 31.93,21.28 31.91,21.3 31.93,21.32 31.88,21.37
N$29
  Top 0.305: U8.3 24.32,22.23
  Top 0.406: 24.32,22.23 C20.2
  pour Top (no thermals): 21.59,22.86 21.46,22.86 20.95,22.35 20.95,22.1 21.46,21.59 25.02,21.59 25.02,22.86
  pour Top (no thermals): 23.5,22.99 27.43,22.99 27.43,21.46 23.5,21.46
N$31  (via drill 0.33 pad 0.18)
  other vias: 14.73,9.27 14.73,8
  pour Top (no thermals): 17.78,7.87 17.78,10.41 16.64,10.41 16.38,10.16 14.86,10.16 13.97,9.27 13.97,7.49 17.4,7.49
  pour Bottom (no thermals): 17.78,10.16 14.99,10.16 14.86,10.16 13.97,9.27 13.97,7.49 17.78,7.49
N$32  (via drill 0.33 pad 0.18)
  other vias: 23.62,8.89 23.62,7.87
  pour Top (no thermals): 19.68,9.4 19.68,6.86 24,6.86 24,9.4 22.23,9.4 22.23,7.75 20.7,7.75 20.45,8 20.45,9.4
  pour Bottom (no thermals): 21.08,7.49 23.88,7.49 24,7.49 24.89,8.38 24.89,10.16 21.08,10.16
N$35  (via drill 0.33 pad 0.18)
  other vias: 58.03,33.47 57.73,43.5 57.36,32.96 57.27,42.89 57.8,34.23
  pour Top (no thermals): 54.86,42.37 56.52,42.37 56.9,42.8 56.9,43.69 57.02,43.81 57.91,43.81 58.04,43.69 58.04,42.67 57.91,42.55 57.4,42.55 56.9,42.06 54.86,42.06
  pour Bottom (no thermals): 55.37,34.04 57.09,34.04 57.4,34.35 57.4,38.73 57.21,38.73 56.9,39.05 56.9,43.69 57.02,43.81 57.91,43.81 58.04,43.69 58.04,39.37 58.42,38.99 58.42,32.77 58.29,32.64 55.5,32.64 55.37,32.77
  pour Top (no thermals): 55.5,33.02 55.63,33.12 56.9,33.12 57.31,33.48 57.32,34.84 57.46,34.95 58.35,34.95 58.46,34.81 58.46,32.74 58.17,32.51 55.63,32.51 55.5,32.64
SCL
  Bottom 0.305: JP2.4 66.74,36.58 67.06,36.89 67.06,46.99 63.31,46.99 62.99,47.31 62.99,49.4 32.58,49.4 32.26,49.09 U16.13
SDA
  Bottom 0.305: JP2.3 66.1,39.12 66.42,39.43 66.42,46.35 62.67,46.35 62.36,46.67 62.36,48.77 34.48,48.77 34.16,48.45 34.16,44.45 30.04,44.45 29.72,44.77 U16.14
SPI_MISO  (via drill 0.33 pad 0.18)
  Top 0.305: JP2.8 64.2,26.42 63.88,26.73 63.88,40.13 62.87,40.13 v62.87,40.26 | U16.8 22.1,32.77 v28.57,32.77 | U8.7 14.3,22.73 14.3,24 15.8,25.5 v15.8,26.9
  Bottom 0.305: v62.87,40.26 62.87,44.83 61.28,44.83 60.96,45.15 60.96,45.72 60.71,45.97 37.72,45.97 37.72,41.59 37.4,41.27 28.77,41.27 28.57,41.08 v28.57,32.77 | v15.8,26.9 20.9,26.9 22.1,28.1 U16.8
SPI_MOSI  (via drill 0.33 pad 0.18)
  Top 0.305: JP2.7 66.99,28.96 67.31,29.27 67.31,46.99 v60.71,46.99
  Bottom 0.305: v60.71,46.99 36.01,46.99 35.69,46.67 35.69,42.35 35.37,42.04 23.5,42.04 23,41.54 23,35 19.56,31.56 U16.7
SPI_SCK  (via drill 0.33 pad 0.18)
  Top 0.305: JP2.9 63.18,23.88 62.87,24.19 v62.87,38.61 | v38.73,43.31 30.04,43.31 29.72,42.99 v29.72,40.39 | v26,35 26.05,35.05 v29.72,35.05 | U8.8 13,22.23 13,24.4 v14.5,25.9
  Bottom 0.305: v62.87,38.61 62.17,38.61 61.85,38.92 61.85,43.94 60.52,43.94 60.2,44.26 60.2,45.09 60.07,45.21 39.18,45.21 38.73,44.77 v38.73,43.31 | v29.72,40.39 v29.72,35.05 | v26,35 26,30.09 U16.9 24.64,26.64 23.9,25.9 v14.5,25.9
SPI_SS_1
  Bottom 0.305: JP2.6 64.2,31.5 63.88,31.81 63.88,45.72 61.91,45.72 61.59,46.04 61.59,48.01 35.24,48.01 34.92,47.69 34.92,44.01 34.61,43.69 22.42,43.69 22.1,43.37 22,43.27 22,37 14.8,37 14.48,36.68 U16.5
SPI_SS_2  (via drill 0.33 pad 0.18)
  Top 0.305: SJ1.3 v53.34,50.29
  Bottom 0.305: v53.34,50.29 63.31,50.29 63.63,49.97 63.63,47.94 63.94,47.62 67.69,47.62 67.69,34.1 67.63,34.04 JP2.5
ST_3V  (via drill 0.33 pad 0.18)
  Top 0.305: U14.2 52.39,33.63 52.07,33.95 v52.07,34.42 | v41.91,33.66 17.34,33.66 17.02,33.97 U16.19
  Bottom 0.305: v52.07,34.42 42.23,34.42 41.91,33.97 v41.91,33.66
ST_SPEC
  Top 0.356: U14.13 49.63,33.63 46.86,30.86 46.86,29.15 46.55,28.83 40.89,28.83 39.37,27.3 JP1.4
TRG_3V  (via drill 0.33 pad 0.18)
  Top 0.305: U14.5 54.8,35.59 54.48,35.9 v54.48,36.7 | v43.31,31.5 43.31,31.43 42.99,31.11 24.96,31.11 24.64,31.43 v24.64,31.88 | v24.64,40.64 U16.16
  Bottom 0.305: v54.48,36.7 54.04,36.7 53.72,36.39 53.72,33.97 53.4,33.53 43.5,33.53 43.31,33.34 v43.31,31.5 | v24.64,31.88 v24.64,40.64
TRG_CAMERA
  Top 0.305: U16.15 27.18,49.09 26.86,49.4 16.57,49.4 16.26,49.72 JP3.4
TRG_FLASH
  Top 0.305: JP3.3 13.21,50.29 13.21,43.97 9.72,43.97 9.4,43.65 U16.3
TRG_IN
  Top 0.305: JP3.5 18.8,50.74 19.11,50.29 SJ1.1
TRG_IN/SPI_SS_2  (via drill 0.33 pad 0.18)
  Top 0.305: SJ1.2 41.91,44.77 41.59,44.45 27.5,44.45 27.18,44.13 v27.18,40.64
  Bottom 0.305: v27.18,40.64 U16.10
TRG_SPEC
  Top 0.356: U14.10 47.4,35.59 46.74,34.92 JP1.7
V_SPEC  (via drill 0.33 pad 0.18)
  other vias: 44.32,26.16 44.32,27.3 43.05,26.04 43.05,27.3 53.42,40 54.42,39.99 53.43,39.17 54.43,39.14
  pour Top (no thermals): 45.47,25.78 44.45,25.78 44.2,25.53 44.2,25.15 43.31,25.15 42.04,23.88 38.1,23.88 37.59,23.88 37.34,23.88 37.21,23.88 36.83,24.26 36.83,25.4 37.34,25.91 37.47,25.91 37.59,26.04 39.12,26.04 40.77,27.69 45.59,27.69 45.59,26.16 45.47,26.04
  pour Bottom (no thermals): 45.72,27.05 45.72,25.65 42.8,25.65 42.67,25.78 42.67,27.43 42.8,27.56 42.93,27.69 45.59,27.69 45.72,27.56
  pour Top (no thermals): 45.59,27.69 56.52,27.69 59.05,30.23 59.05,38.23 58.55,38.73 51.82,38.73 50.24,40.05 50.24,41.7 51.82,41.66 51.82,40.77 52.32,40.26 59.05,40.26 60.71,38.61 60.71,29.08 57.28,25.65 45.59,25.65
  pour Top (no thermals): 49.78,36.83 49.78,39.37 50.42,40.01 52.07,40.01 52.07,38.99 51.18,38.1 51.18,36.83
  pour Top (no thermals): 49.78,33.02 53.21,33.02 55.88,30.48 59.69,30.48 59.69,29.21 57.15,26.67 55.88,27.94 55.88,29.34 52.83,32.38 49.78,32.38
  pour Bottom (no thermals): 50.76,40.33 52.69,40.33 52.69,40.38 52.91,40.6 52.98,40.67 54.88,40.67 55.31,40.24 55.31,38.96 54.86,38.51 50.79,38.51 50.77,38.53 50.74,38.56 50.77,38.59 50.61,38.75 50.61,40.17 50.76,40.32
VIDEO_SPEC
  pour Top (no thermals): 31.17,20.81 32.37,20.81 34.63,23.07 39.13,23.07 39.38,22.82 39.38,21.62 38.8,21.07 36.86,21.07 36.28,20.46 36.28,19.45 36.06,19.22 31.16,19.23 31.17,19.48
VIN  (via drill 0.33 pad 0.18)
  Top 0.813: 4.39,20.9 4.32,20.83 | 4.32,22.86 4.39,22.78 U10.1 | U10.3 7.85,15.47 7.62,15.24
  Top 1.27: 18.92,13.72 17.78,15.24 7.62,15.24 5.32,15.24 4.32,16.24 4.32,20.83 4.32,22.86 U16.1
  other vias: 6.22,22.73 6.22,23.5
  pour Top (no thermals): 8.38,22.86 8.38,24.64 8.13,24.89 4.57,24.89 4.45,24.77 4.45,22.86 4.7,22.61 8.13,22.61
  pour Top (no thermals): 18.54,9.27 19.05,9.27 19.05,10.29 19.05,10.92 19.56,11.43 19.56,12.45 18.29,12.45 18.29,11.56 18.29,10.67 18.54,10.41
  pour Top (no thermals): 18.54,14.48 19.05,14.48 20.7,12.32 23.5,12.32 23.5,11.05 18.54,11.05
  pour Bottom (no thermals): 8.51,22.23 5.97,22.23 5.71,22.48 5.71,23.75 5.84,23.88 7.11,23.88 7.62,23.37 8.51,23.37

### Text on the board
tPlace: 3.3V | CAMERA | GND | FLASH | TRG_IN | Trigger IN | SPI Select (SD) | GND | 3.3V | SDA | Spectron rev 2.0 / 2016 | SCL | SPI Sel 2 (SD) | SPI Sel 1 (LCD) | SPI MOSI | SPI MISO | SPI SCK | D_PWM
bPlace: GAIN | TRIGGER | EOS | CLK | ST | VDD | VIDEO | GND